# Altium project JTAG2SW.PrjPcb
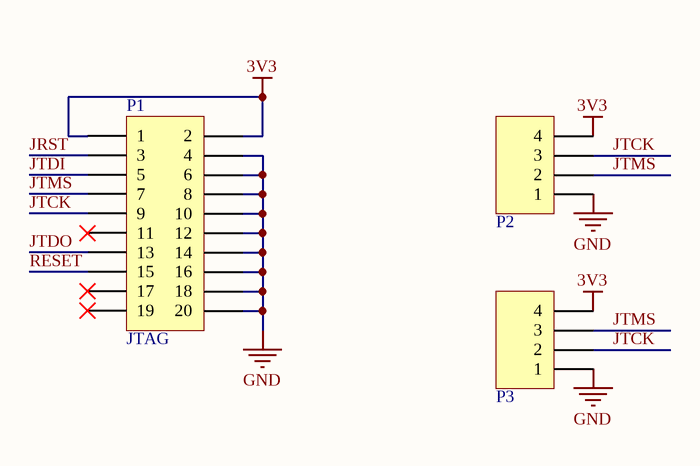
[diagram p0: JTAG2SW.SchDoc]
1 sheet, 3 parts. Net scope: global (net labels, ports and power ports of the same name join across sheets).
Board file: JTAG2SW.PcbDoc

## Sheet JTAG2SW.SchDoc
size A4

### Parts
P1  JTAG  [HDR10X2_SMT]
P2  Header 4  [HDR4X1_TP]  (value not drawn)
P3  Header 4  [HDR4X1_TP]  (value not drawn)

### Nets
3V3: P1.1 P1.2 P2.4 P3.4
GND: P1.4 P1.6 P1.8 P1.10 P1.12 P1.14 P1.16 P1.18 P1.20 P2.1 P3.1
JRST: P1.3
JTCK: P1.9 P2.3 P3.2
JTDI: P1.5
JTDO: P1.13
JTMS: P1.7 P2.2 P3.3
RESET: P1.15

Not connected (* = marked no-connect by the designer): P1 11* 17* 19*

### Library data of the parts
P1 = Header 10X2: Header, 10-Pin; LatestRevisionDate: 17-Jul-2002; LatestRevisionNote: Re-released for DXP Platform.; Publisher: Altium Limited
P2 P3 = Header 4: 接插件; LatestRevisionDate: 17-Jul-2002; LatestRevisionNote: Re-released for DXP Platform.; Publisher: Altium Limited